# Altium schematic sheet USB.SchDoc
size A4
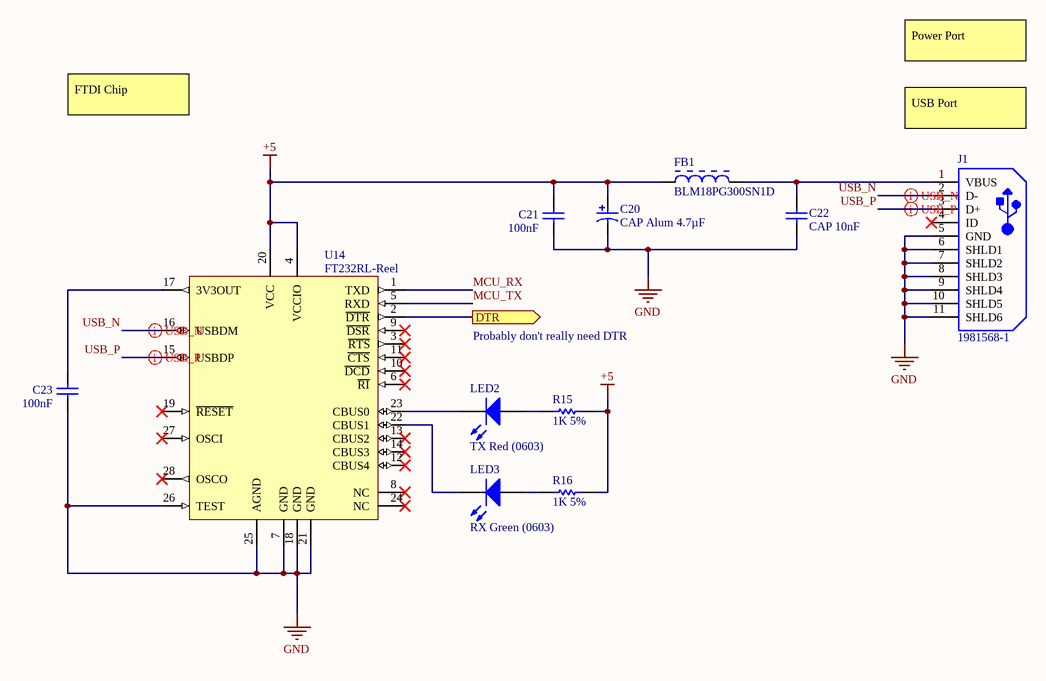
[diagram p0: USB.SchDoc]

## Parts
C20  CAP Alum 4.7µF  [NIC-CAPA2-4X5.8_V]
C21  100nF  [CAPC0603(1608)100_M]
C22  CAP 10nF  [CAPC0603(1608)100_M]
C23  100nF  [CAPC0603(1608)100_M]
FB1  BLM18PG300SN1D  [MURA-BLM18PG_KG-CHIP-2_V1]
J1  1981568-1  [TECO-1981568-5_V]
LED2  TX Red (0603)  [0603_A]
LED3  RX Green (0603)  [LITE-ON-LTST-C191KRKT-2_V]
R15  1K 5%  [RESC0603(1608)_L]
R16  1K 5%  [RESC0603(1608)_L]
U14  FT232RL-Reel  [SSOP-28_L]

## Ports
DTR (out)

## Nets
+5: C20.1 C21.2 FB1.1 R15.1 R16.1 U14.4(VCCIO) U14.20(VCC)
GND: C20.2 C21.1 C22.1 C23.1 J1.5(GND) J1.6(SHLD1) J1.7(SHLD2) J1.8(SHLD3) J1.9(SHLD4) J1.10(SHLD5) J1.11(SHLD6) U14.7(GND) U14.18(GND) U14.21(GND) U14.25(AGND) U14.26(TEST)
DTR: U14.2(~{DTR}) ; port DTR
MCU_RX: U14.1(TXD)
MCU_TX: U14.5(RXD)
USB_N: J1.2(D-) U14.16(USBDM)
USB_P: J1.3(D+) U14.15(USBDP)
NetC22_2: C22.2 FB1.2 J1.1(VBUS)
NetC23_2: C23.2 U14.17(3V3OUT)
NetLED2_1: LED2.1(K) U14.23(CBUS0)
NetLED2_2: LED2.2(A) R15.2
NetLED3_1: LED3.1(A) R16.2
NetLED3_2: LED3.2(K) U14.22(CBUS1)

Not connected (* = marked no-connect by the designer): J1 4(ID)*; U14 3(~{RTS})* 6(~{RI})* 8(NC)* 9(~{DSR})* 10(~{DCD})* 11(~{CTS})* 12(CBUS4)* 13(CBUS2)* 14(CBUS3)* 19(~{RESET})* 24(NC)* 27(OSCI)* 28(OSCO)*

## Layout directives
differential pair; differential pair class USB_N; rule Differential Pairs Routing [Pref Gap = 10mil    Min Gap  = 10mil    Max Gap  = 10milPref Width = 15mil    Min Width  = 15mil    Max Width  = 15mil]: USB_N
differential pair; differential pair class USB_P; rule Differential Pairs Routing [Pref Gap = 10mil    Min Gap  = 10mil    Max Gap  = 10milPref Width = 15mil    Min Width  = 15mil    Max Width  = 15mil]: USB_P

## Notes on the sheet
- Power Port
- FTDI Chip
- USB Port
- Probably don't really need DTR

## Library data of the parts
C20 = CMP-0687-00013-1: Aluminum Electrolytic Capacitor, UD Series, Low Impedance, 4.7 uF, 35 V, + / - 20%, -55 to 105 degC, Chip Type, 4 x 5.8 mm D x L, Pb-Free, Reel / UUD1V4R7MCL1GS; Manufacturer: Nichicon; Rated Voltage: 35 V; Packing: Dia382mm Reel; Rated Ripple Current (at 100kHz): 80 mA; Rated Capacitance: 4.7 uF; Impedance: 1.8 Ohm; Endurance Time: 2000 h; Tolerance Rated Capacitance: -20 to 20%; Diameter: 4 mm; Length: 5.8 mm; ComponentLink2Description: Datasheet; DatasheetVersion: 08/2012; Mounting Technology: Surface Mount; PackageDescription: 2-Pin Surface Mount Device, Diameter 4 mm, Height 5.8 mm, Pitch 3.6 mm; ComponentLink2URL: http://products.nichicon.co.jp/en/pdf/XJA043/e-ud.pdf; ComponentLink1Description: Manufacturer URL; PackageReference: CAPAE-D4H5.8; ComponentLink3Description: Package Specification; RoHS: TRUE; ComponentLink1URL: http://www.nichicon.co.jp/; PartNumber: UUD1V4R7MCL1GS; ComponentLink3URL: http://products.nichicon.co.jp/en/pdf/XJA043/e-ud.pdf
C21 C23 = CMP-1035-02583-1: CAP 100nF 16V ±5% 0603 (1608 Metric) Thickness 1mm SMD; Tolerance: Â±5%; Case-Metric: 1608; Case-EIA: 0603; Rated Voltage: 16 V; Max Thickness: 1 mm; Technology: SMT; Value: 100nF
C22 = CMP-1035-02306-1: CAP 10nF 10V ±10% 0603 (1608 Metric) Thickness 1mm SMD; Tolerance: Â±10%; Case-EIA: 0603; Case-Metric: 1608; Rated Voltage: 10 V; Value: 10nF; Technology: SMT; Max Thickness: 1 mm
FB1 = CMP-0686-00572-2: Chip Ferrite Bead for Power Lines, 30 Ohm, 1000 mA, -55 to 125 degC, 1.6 x 0.8 x 0.95 mm SMD, Tape and Reel; Manufacturer: Murata; DC Resistance: 0.05 Ohm Max.; Impedance (at 100 MHz): 30 Ohm Typ.; Rated Current: 1000 mA; ComponentLink1Description: Manufacturer URL; Packing: Tape and Reel; ComponentLink2URL: http://www.murata.com/products/catalog/pdf/c31e.pdf; DatasheetVersion: 08/2013; PartNumber: BLM18PG300SN1D; Mounting Technology: Surface Mount; ComponentLink2Description: Datasheet; PackageReference: BLM18_H950-2; Operating Temperature Range: -55 to 125 degC; ComponentLink3Description: Package Specification; PackageDescription: 2-Pin Chip, Body 1.6 x 0.8 mm; ComponentLink1URL: http://www.murata.com/; ComponentLink3URL: http://www.murata.com/products/catalog/pdf/c31e.pdf
J1 = CMP-2000-05408-1: Micro USB Receptacle Standard Type B Assy, 5-Pin SMD, RoHS, Tape and Reel; Manufacturer: TE Connectivity; Body Orientation: RightAngle; Number of Ports: 1Port; Number of Contacts: 5POS; Gender: RCP; Voltage Rating Max: 30VAC; Product Depth (mm): 5.6mm; Pitch (mm): 0.65mm; Current Rating (Max): 1/ContactA; Product Length (mm): 8mm; Product Height (mm): 3mm; Operating Temperature Max Deg. C: 85C; Datasheet URL: http://www.mouser.com/ds/2/418/NG_CD_1981568_E2-621296.pdf; Termination Method: Solder; Number of Terminals: 5; Operating Temp Range: -55Cto85C; Mounting Style: SurfaceMount; Manufacturer URL: http://www.te.com/; Contact Material: CopperAlloy; Packaging: TapeandReel; Datasheet Version: Rev. E2, 08/2015; Operating Temperature Min Deg. C: -55C; Housing Material: Thermoplastic; Type: MicroUSB; Contact Plating: GoldOverNickel
LED2 = CMP-1426-00001-1: SMD mono-color Chip LED, WL-SMCW, Red; Manufacturer: Wuerth Elektronik; PartNumber: 150060RS75000; Color: Red; PackageReference: 0603_A; ComponentLink2URL: http://katalog.we-online.com/led/datasheet/150060RS75000.pdf; ComponentLink1URL: http://www.we-online.com; ComponentLink1Description: Manufacturer URL; ComponentLink2Description: Datasheet
LED3 = CMP-2000-05198-1: Chip LED, Green, 574 nm, 40 pF, -55 to 85 degC, 2-Pin SMD, RoHS, Tape and Reel; Manufacturer: Lite-On; Rad Hardened: No; Emitting Color: YellowGreen; Product Height (mm): 0.55mm; Forward Voltage: 2.4V; Number of Elements: 1; Dominant Wave Length: 571nm; DELETED: Compliant; Viewing Angle: 130deg; High Brightness: Yes; Peak Wavelength: 574nm; Type: Uni-Color; Forward Current: 30mA; Product Length (mm): 1.6mm; Luminous Intensity: 35mcd; Test Current (It): 20mA; Chip Material: AlGaInP; Product Depth (mm): 0.8mm; Shape Type: Rectangular; Reverse Voltage: 5V; Power Dissipation: 75W; Pin Count: 2; Lens Dimensions: 1.1X0.8X0.37mm; Packaging: TapeandReel; Main Category: ChipLED; Operating Temperature Classification: Industrial; Package Type: ChipLed; Mounting: SurfaceMount; Lum Intensity: 35mcd; Operating Temp Range: -55Cto85C; Datasheet Version: Jan-07; Datasheet URL: http://download.siliconexpert.com/pdfs/2007/08/26/semi_b/manual/lot/ds/ltst-c191kgkt.pdf; Manufacturer URL: http://www.us.liteon.com/
R15 R16 = CMP-1012-00074-1: 1K 0.1W 5% 0603 (1608 Metric)  SMD; Case-EIA: 0603; Case-Metric: 1608; Value: 1000.00 Ohm; Technology: SMT; Tolerance: 5 %; Power: 0.1 W
U14 = CMP-0078-00029-3: USB UART Asynchronous Serial Data Transfer Chip, 28-pin SSOP, Tape and Reel; Manufacturer: FTDI; PackageVersion: Mar-12; PackageReference: SSOP-28; ComponentLink2Description: Datasheet; DatasheetVersion: ver 2.10, Mar-2012; PackageDescription: 28-Pin Small Outline Package 0.65 mm Pitch; ComponentLink1Description: Manufacturer URL; RevisionNote: DatasheetVersion updated to 2.10 Mar-2012; PartNumber: FT232RL-Reel; ComponentLink1URL: http://www.ftdichip.com/; ComponentLink2URL: http://www.ftdichip.com/Support/Documents/DataSheets/ICs/DS_FT232R.pdf